# EAGLE design GCS (EAGLE 9.3.0)
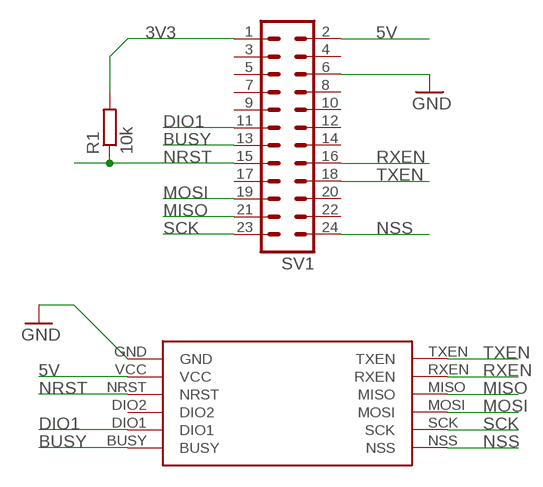
[diagram p0: schematic, sheet 1]

## Parts
R1  10k  R-EU_0207/10  [0207/10]
SV1  MA12-2  [MA12-2]
U$1  E22_PLATE  [E22_PLATE]

## Nets
3V3: R1.2 SV1.1
5V: SV1.2 U$1.VCC
BUSY: SV1.13 U$1.BUSY
DIO1: SV1.11 U$1.DIO1
GND: SV1.6 U$1.GND
MISO: SV1.21 U$1.MISO
MOSI: SV1.19 U$1.MOSI
NRST: R1.1 SV1.15 U$1.NRST
NSS: SV1.24 U$1.NSS
RXEN: SV1.16 U$1.RXEN
SCK: SV1.23 U$1.SCK
TXEN: SV1.18 U$1.TXEN
Unconnected: SV1.3 SV1.4 SV1.5 SV1.7 SV1.8 SV1.9 SV1.10 SV1.12 SV1.14 SV1.17 SV1.20 SV1.22 U$1.DIO2

## Library data of the parts
R1 = rcl:R-EU_: RESISTOR, European symbol; SPICEPREFIX: R
SV1 = con-lstb:MA12-2: PIN HEADER; OC_FARNELL: unknown; OC_NEWARK: unknown
U$1 = bluepill:E22_PLATE

## Board
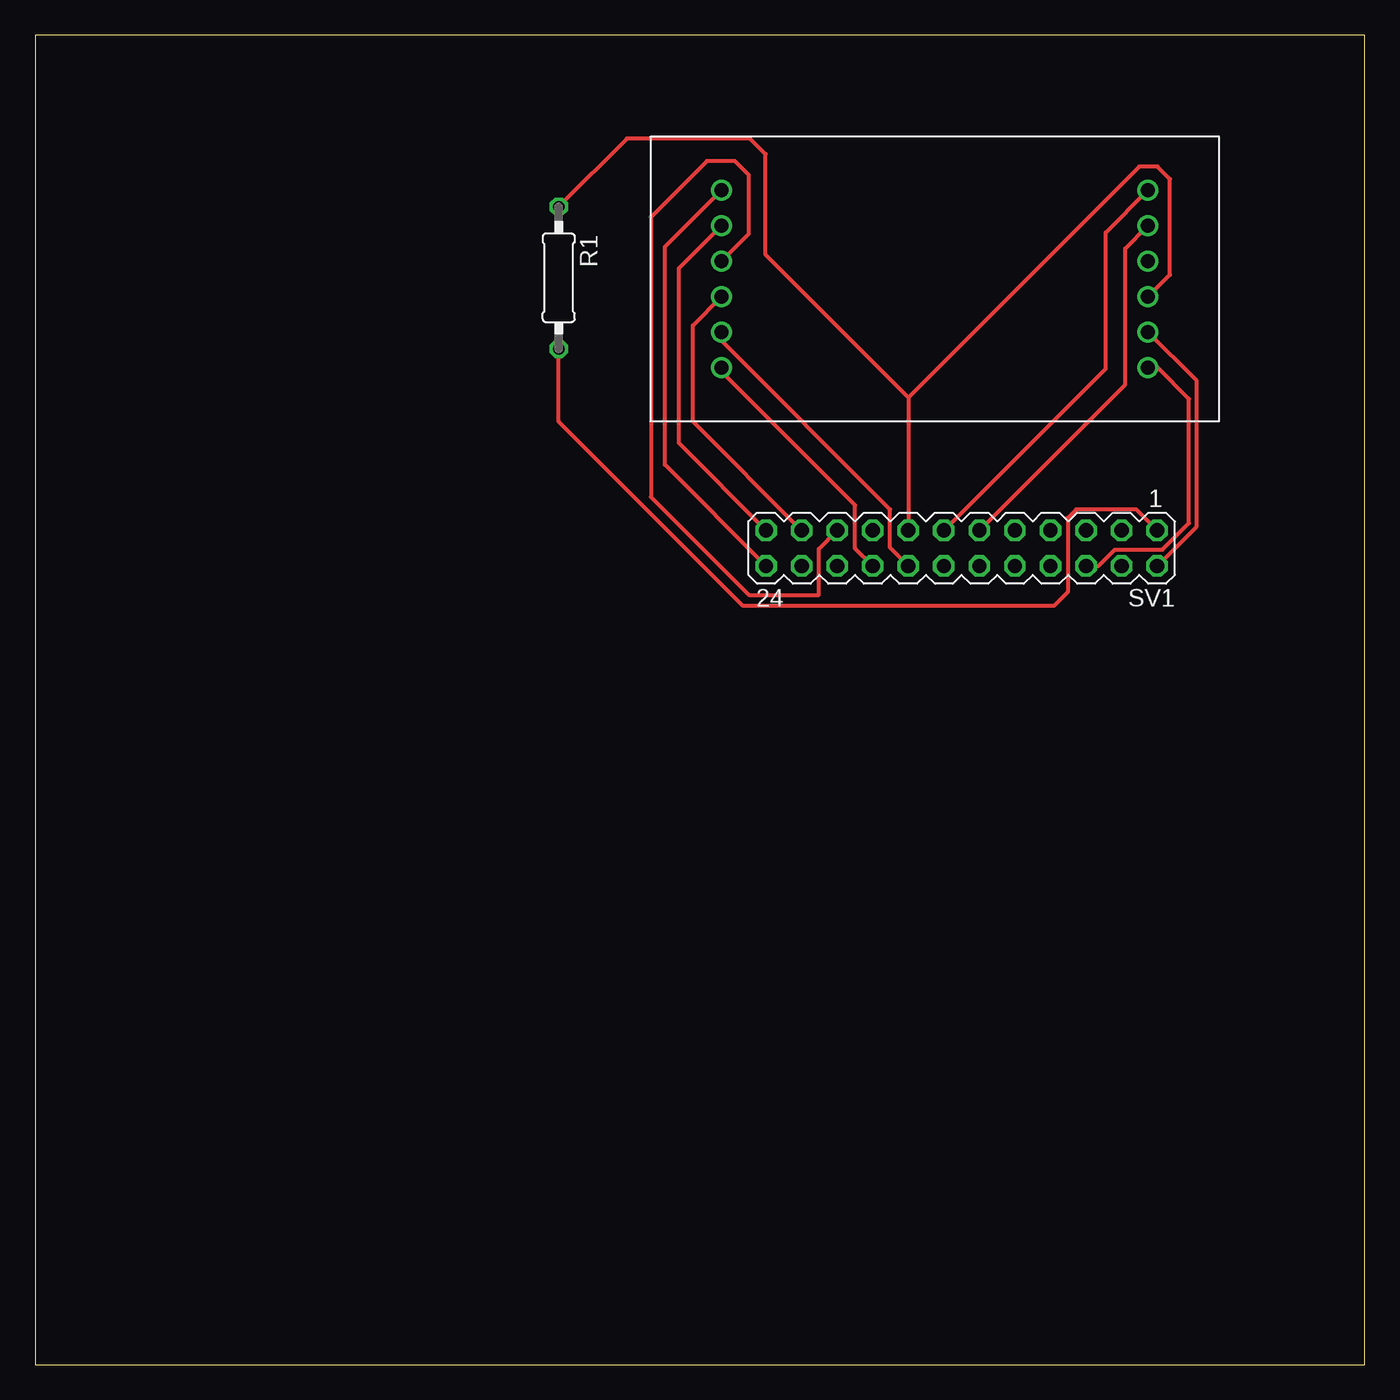
[diagram p1: board, top side]

Size 95 x 95 mm. Coordinates in mm from the lower left corner, seen from the top.
Outline: 0,0 95,0 95,95 0,95 0,0
Copper layers (1*16): Top 0.035mm / dielectric 1mm / Bottom 0.035mm
Design rules "rezonit": minimum track width 0.2mm, minimum drill 0.5mm, track to track 0.25mm, track to pad 0.25mm, pad to pad 0.25mm, via to via 0.25mm, smd to smd 0.2mm, copper to edge 0.4mm, drill to drill 0.4mm, minimum pad ring 0.25mm, minimum via ring 0.25mm, stop-mask expansion 4mil, vias tented up to drill 0.6mm, thermal gap 10mil

### Footprints (pad centres in the part's own frame; a part is rotated, then mirrored left to right if it is on the bottom)
0207/10 = drill 0.813 octagon: 1 -5.08,0; 2 5.08,0
MA12-2 = drill 1.016 octagon: 1 -13.97,-1.27; 2 -13.97,1.27; 3 -11.43,-1.27; 4 -11.43,1.27; 5 -8.89,-1.27; 6 -8.89,1.27; 7 -6.35,-1.27; 8 -6.35,1.27; 9 -3.81,-1.27; 10 -3.81,1.27; 11 -1.27,-1.27; 12 -1.27,1.27; 13 1.27,-1.27; 14 1.27,1.27; 15 3.81,-1.27; 16 3.81,1.27; 17 6.35,-1.27; 18 6.35,1.27; 19 8.89,-1.27; 20 8.89,1.27; 21 11.43,-1.27; 22 11.43,1.27; 23 13.97,-1.27; 24 13.97,1.27
E22_PLATE = drill 1: BUSY -15.24,-6.35; DIO1 -15.24,-3.81; DIO2 -15.24,-1.27; GND -15.24,6.35; MISO 15.24,1.27; MOSI 15.24,-1.27; NRST -15.24,1.27; NSS 15.24,-6.35; RXEN 15.24,3.81; SCK 15.24,-3.81; TXEN 15.24,6.35; VCC -15.24,3.81

### Placement (x,y rotation side)
R1  37.42,77.65 270 top
SV1  66.21,58.33 180 top
U$1  64.29,77.57 180 top

### Tracks (layer width: path | path; a pad name or v marks a point on that pad's centre or on a via)
3V3
  Top 0.3: SV1.1 78.68,61.1 74.4,61.1 73.8,60.5 73.8,55.2 72.8,54.2 50.6,54.2 37.42,67.38 R1.2
5V
  Top 0.3: SV1.2 83,59.88 83,70.29 U$1.VCC
BUSY
  Top 0.3: SV1.13 76.5,71.16 76.5,80.89 U$1.BUSY
DIO1
  Top 0.3: SV1.11 77.9,70.02 77.9,79.75 U$1.DIO1
GND
  Top 0.3: SV1.6 76,57.06 77.16,58.22 80.56,58.22 82.45,60.11 82.45,69 80.23,71.22 U$1.GND
MISO
  Top 0.3: SV1.21 47,67.38 47,74.25 U$1.MISO
MOSI
  Top 0.3: U$1.MOSI 51,80.79 51,85 50,86 48,86 44,82 44,62 51,55 56,55 56,58.28 SV1.19
NRST
  Top 0.3: U$1.NRST 81.1,77.87 81.1,84.7 80.2,85.6 78.9,85.6 62.4,69.1 | 62.4,69.1 SV1.15 | 62.4,69.1 52.2,79.3 52.2,86.5 51.1,87.6 42.29,87.6 R1.1
NSS
  Top 0.3: SV1.24 45,64.3 45,79.87 U$1.NSS
RXEN
  Top 0.3: SV1.16 61.1,58.36 61.1,61.1 49.05,73.15 U$1.RXEN
SCK
  Top 0.3: SV1.23 46,65.84 46,78.33 U$1.SCK
TXEN
  Top 0.3: SV1.18 58.6,58.32 58.6,61.4 49.05,70.95 U$1.TXEN